# EAGLE design loochi-0.3a (EAGLE 6.2)
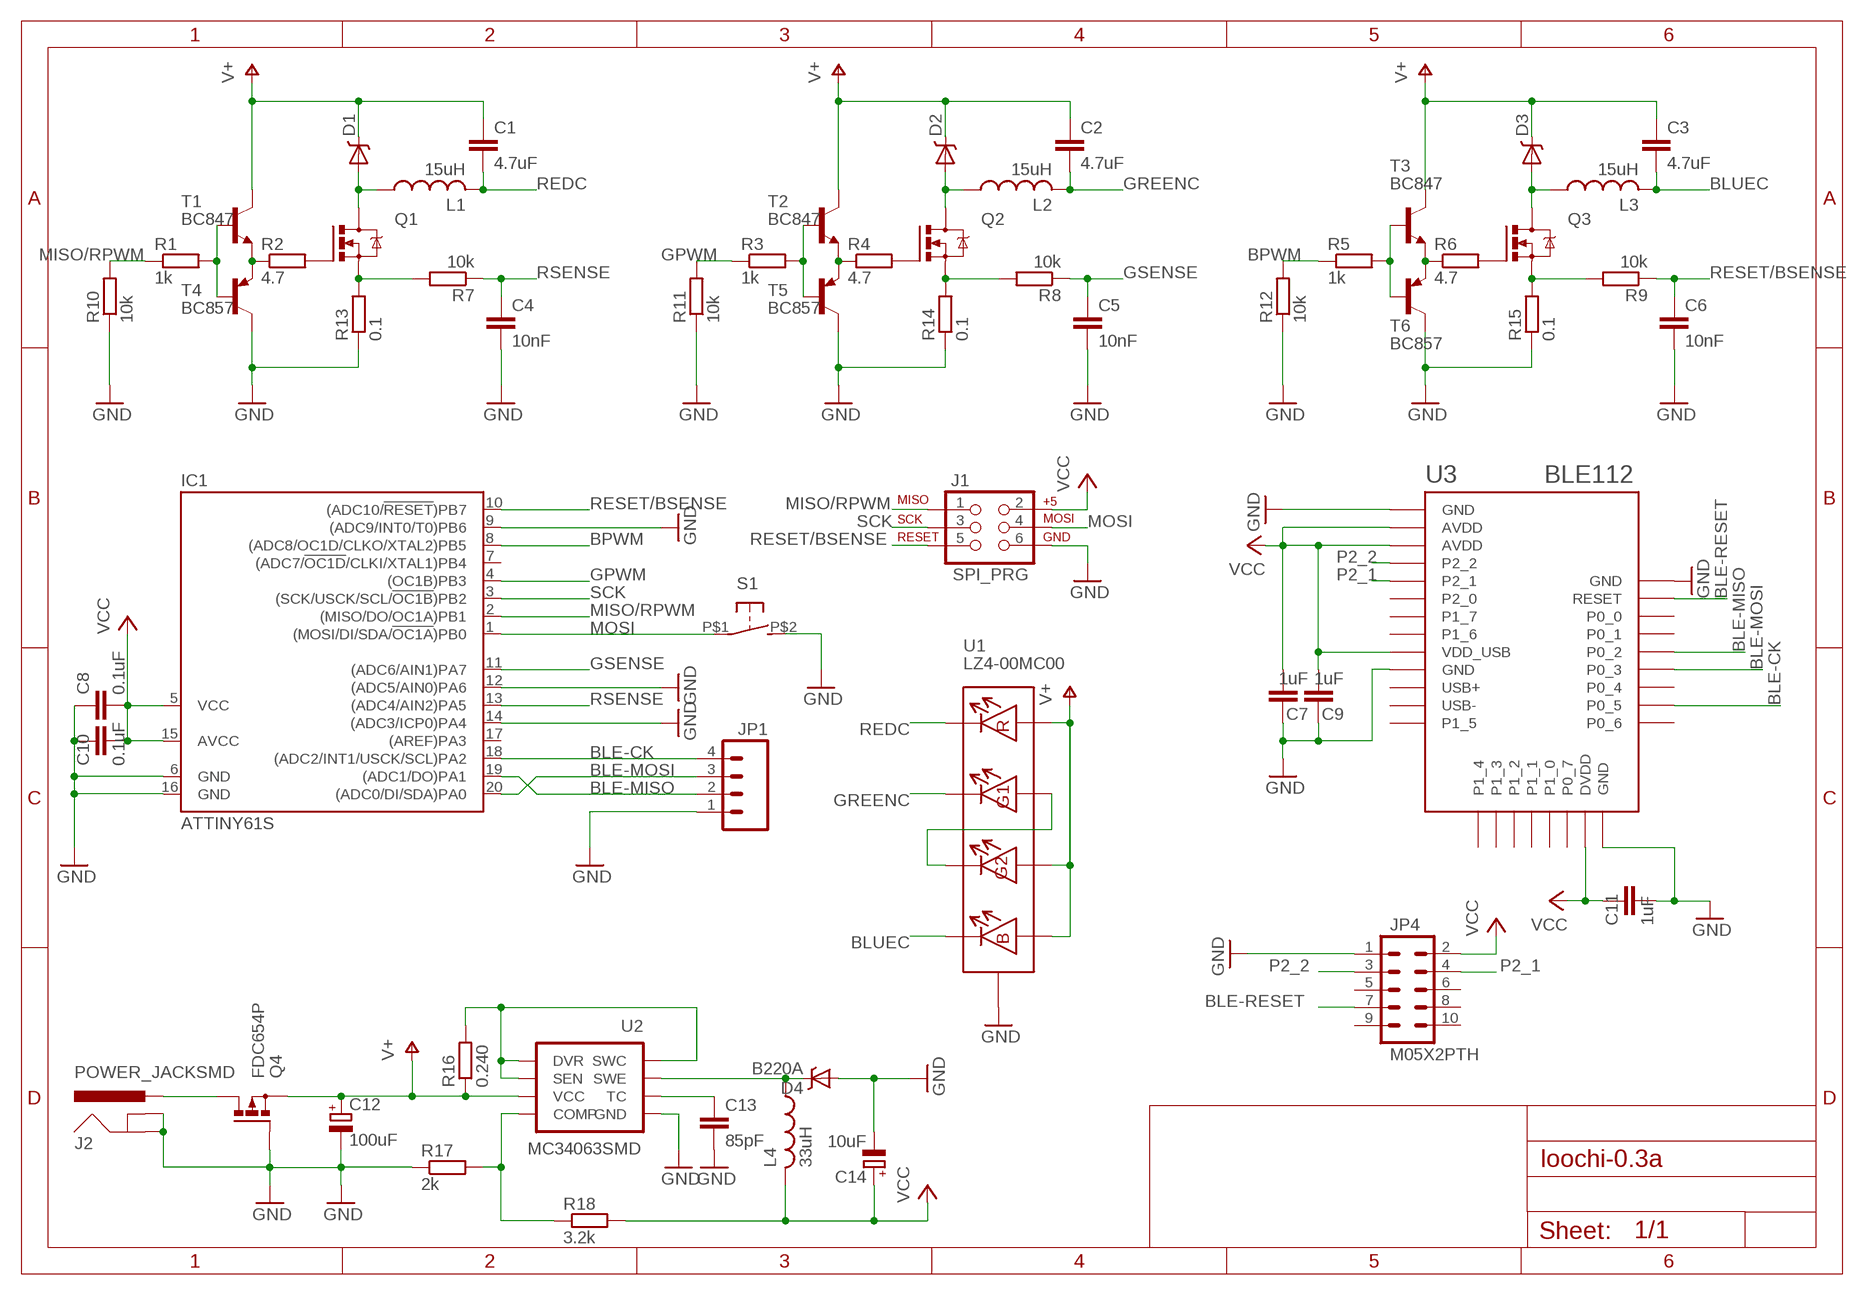
[diagram p0: schematic, sheet 1]

## Parts
C1  4.7uF  C-EUC0805  [C0805]
C2  4.7uF  C-EUC0805  [C0805]
C3  4.7uF  C-EUC0805  [C0805]
C4  10nF  C-EUC0805  [C0805]
C5  10nF  C-EUC0805  [C0805]
C6  10nF  C-EUC0805  [C0805]
C7  1uF  C-EUC0805  [C0805]
C8  0.1uF  C-EUC0805  [C0805]
C9  1uF  C-EUC0805  [C0805]
C10  0.1uF  C-EUC0805  [C0805]
C11  1uF  C-EUC0805  [C0805]
C12  100uF  CPOL-EUD  [PANASONIC_D]
C13  85pF  C-EUC0805  [C0805]
C14  10uF  CPOL-EUUD-4X5,8  [UD-4X5,8_NICHICON]
D1  PMEG4010CEH  DIODE-SCHOTTKY  [SOD123F]
D2  PMEG4010CEH  DIODE-SCHOTTKY  [SOD123F]
D3  PMEG4010CEH  DIODE-SCHOTTKY  [SOD123F]
D4  B220A  DIODE-SCHOTTKYBIGPAD  [SMA-DIODE-BIG]
IC1  ATTINY61S  [SO20L]
J1  SPI_PRG  AVR_SPI_PRG_6NS  [2X3-NS]
J2  POWER_JACKSMD  [POWER_JACK_SMD]
JP1  M04PTH  [1X04]
JP4  M05X2PTH  [AVR_ICSP]
L1  15uH  L-USBOURNS-6045  [BOURNS-6045]
L2  15uH  L-USBOURNS-6045  [BOURNS-6045]
L3  15uH  L-USBOURNS-6045  [BOURNS-6045]
L4  33uH  L-USBOURNS-6045  [BOURNS-6045]
Q1  PMN25ENSOT457  [SOT457]
Q2  PMN25ENSOT457  [SOT457]
Q3  PMN25ENSOT457  [SOT457]
Q4  FDC654P  [SUPERSOT6]
R1  1k  R-EU_R0805  [R0805]
R2  4.7  R-EU_R0805  [R0805]
R3  1k  R-EU_R0805  [R0805]
R4  4.7  R-EU_R0805  [R0805]
R5  1k  R-EU_R0805  [R0805]
R6  4.7  R-EU_R0805  [R0805]
R7  10k  R-EU_R0805  [R0805]
R8  10k  R-EU_R0805  [R0805]
R9  10k  R-EU_R0805  [R0805]
R10  10k  R-EU_R0805  [R0805]
R11  10k  R-EU_R0805  [R0805]
R12  10k  R-EU_R0805  [R0805]
R13  0.1  R-EU_R0805  [R0805]
R14  0.1  R-EU_R0805  [R0805]
R15  0.1  R-EU_R0805  [R0805]
R16  0.240  R-EU_R0805  [R0805]
R17  2k  R-EU_R0805  [R0805]
R18  3.2k  R-EU_R0805  [R0805]
S1  ALPS-SKRK39X29  [ALPS-SKRK-39X29]
T1  BC847  [SOT23]
T2  BC847  [SOT23]
T3  BC847  [SOT23]
T4  BC857  BC857A-PNP-SOT23-BEC  [SOT23-BEC]
T5  BC857  BC857A-PNP-SOT23-BEC  [SOT23-BEC]
T6  BC857  BC857A-PNP-SOT23-BEC  [SOT23-BEC]
U1  LZ4-00MC00  [LZ4-00MC00]
U2  MC34063SMD  [SO08]
U3  BLE112  SF-BLUEGIGA_BLE112-A-VISUAL  [SF-BLUEGIGA_BLE112-A]

## Nets
BLE-CK: IC1.18((ADC2/INT1/USCK/SCL)PA2) JP1.4 U3.P0_5
BLE-MISO: IC1.19((ADC1/DO)PA1) JP1.2 U3.P0_2
BLE-MOSI: IC1.20((ADC0/DI/SDA)PA0) JP1.3 U3.P0_3
BLE-RESET: JP4.7 U3.RESET
BLUEC: C3.2 L3.P$2 U1.P$8
BPWM: IC1.8((ADC8/OC1D/CLKO/XTAL2)PB5) R5.1 R12.2
GND: C4.2 C5.2 C6.2 C7.1 C8.1 C9.1 C10.1 C11.2 C12.- C13.2 C14.- D4.A IC1.6(GND) IC1.9((ADC9/INT0/T0)PB6) IC1.12((ADC5/AIN0)PA6) IC1.14((ADC3/ICP0)PA4) IC1.16(GND) J1.6 J2.GND(GNDBREAK) J2.P$4(GND) JP1.1 JP4.1 Q4.P$3(G) R10.1 R11.1 R12.1 R13.1 R14.1 R15.1 R17.1 S1.P$2(S) T4.C T5.C T6.C U1.THERMAL U1.THERMAL-VIA2(THERMAL) U1.THERMAL-VIA(THERMAL) U2.4(GND) U3.GND1(GND) U3.GND2(GND) U3.GND3(GND) U3.GND4(GND)
GPWM: IC1.4((OC1B)PB3) R3.1 R11.2
GREENC: C2.2 L2.P$2 U1.P$6
GSENSE: C5.1 IC1.11((ADC6/AIN1)PA7) R8.1
MISO/RPWM: IC1.2((MISO/DO/OC1A)PB1) J1.1 R1.1 R10.2
MOSI: IC1.1((MOSI/DI/SDA/!OC1A!)PB0) J1.4 S1.P$1(P)
N$1: U1.P$1 U1.P$5
N$3: R2.1 T1.2(E) T4.E
N$4: R1.2 T1.1(B) T4.B
N$5: Q1.P$3(G) R2.2
N$7: Q1.P$4(S) R7.2 R13.2
N$8: D1.P$A(A) L1.P$1 Q1.P$1(D) Q1.P$2(D) Q1.P$5(D) Q1.P$6(D)
N$9: R4.1 T2.2(E) T5.E
N$10: J2.VIN0(PWR) J2.VIN1(PWR) Q4.P$1(D) Q4.P$2(D) Q4.P$5(D) Q4.P$6(D)
N$11: R3.2 T2.1(B) T5.B
N$12: Q2.P$3(G) R4.2
N$14: D2.P$A(A) L2.P$1 Q2.P$1(D) Q2.P$2(D) Q2.P$5(D) Q2.P$6(D)
N$16: R16.2 U2.1(SWC) U2.7(SEN) U2.8(DVR)
N$17: Q2.P$4(S) R8.2 R14.2
N$18: C13.1 U2.3(TC)
N$19: R6.1 T3.2(E) T6.E
N$20: R5.2 T3.1(B) T6.B
N$21: Q3.P$3(G) R6.2
N$23: D3.P$A(A) L3.P$1 Q3.P$1(D) Q3.P$2(D) Q3.P$5(D) Q3.P$6(D)
N$24: D4.C L4.P$1 U2.2(SWE)
N$25: Q3.P$4(S) R9.2 R15.2
N$26: R17.2 R18.1 U2.5(COMP)
P2_1: JP4.4 U3.P2_1
P2_2: JP4.3 U3.P2_2
REDC: C1.2 L1.P$2 U1.P$4
RESET/BSENSE: C6.1 IC1.10((ADC10/!RESET!)PB7) J1.5 R9.1
RSENSE: C4.1 IC1.13((ADC4/AIN2)PA5) R7.1
SCK: IC1.3((SCK/USCK/SCL/!OC1B!)PB2) J1.3
V+: C1.1 C2.1 C3.1 C12.+ D1.P$C(C) D2.P$C(C) D3.P$C(C) Q4.P$4(S) R16.1 T1.3(C) T2.3(C) T3.3(C) U1.P$2 U1.P$3 U1.P$7 U2.6(VCC)
VCC: C7.2 C8.2 C9.2 C10.2 C11.1 C14.+ IC1.5(VCC) IC1.15(AVCC) J1.2 JP4.2 L4.P$2 R18.2 U3.AVDD1(AVDD) U3.AVDD2(AVDD) U3.DVDD U3.VDD_USB
Unconnected: IC1.7((ADC7/!OC1D!/CLKI/XTAL1)PB4) IC1.17((AREF)PA3) JP4.5 JP4.6 JP4.8 JP4.9 JP4.10 U3.P0_0 U3.P0_1 U3.P0_4 U3.P0_6 U3.P0_7 U3.P1_0 U3.P1_1 U3.P1_2 U3.P1_3 U3.P1_4 U3.P1_5 U3.P1_6 U3.P1_7 U3.P2_0 U3.USB+ U3.USB-

## Library data of the parts
C1-C11 C13 = rcl:C-EU: CAPACITOR, European symbol
C12 C14 = rcl:CPOL-EU: POLARIZED CAPACITOR, European symbol
D1-D4 = diode-schottky:DIODE-SCHOTTKY
IC1 = attinyx61:ATTINY*61: AtTinyX61; MPN: ATTINY261-20SU; OC_FARNELL: 1455147; OC_NEWARK: 58M3783
J1 = SparkFun:AVR_SPI_PRG_6: AVR ISP 6 Pin This is the reduced ISP connector for AVR programming. Common on Arduino. This footprint will take up less PCB space and can be used with a 10-pin to 6-pin adapter such as SKU: BOB-08508
J2 = SparkFun:POWER_JACK: Power Jack This is the standard 5.5mm barrel jack for power. The PTH is the most common, proven, reliable, footprint. All others are experimental. The Slot footprint only works if the mill layer is transmitted to the PCB fab house so be warned. Spark Fun Electronics SKU : PRT-00119. Mating wall wart : TOL-00298 (and others)
JP1 = SparkFun:M04: Header 4 Standard 4-pin 0.1" header. Use with straight break away headers (SKU : PRT-00116), right angle break away headers (PRT-00553), swiss pins (PRT-00743), machine pins (PRT-00117), and female headers (PRT-00115). Molex polarized connector foot print use with SKU : PRT-08231 with associated crimp pins and housings. 1MM SMD Version SKU: PRT-10208
JP4 = SparkFun:M05X2: Header 5x2 Standard 10-pin dual row 0.1" header. Commonly used with AVR-ISP. Use with Spark Fun Electronics SKU: PRT-00778
L1-L4 = inductors:L-US: INDUCTOR, American symbol
Q1-Q3 = mosfet:PMN25EN: N-CHANNEL MOS FET
Q4 = mosfet:FDC654P: FDC654P
R1-R18 = rcl:R-EU_: RESISTOR, European symbol
S1 = buttons:ALPS-SKRK: OMRON SWITCH
T1-T3 = transistor:BC847: NPN TRANSISTOR
T4-T6 = transistor:*-PNP-: PNP Transistror
U1 = ledengin:LZ4-00MC00
U2 = SparkFun:MC34063
U3 = ble112:SF-BLUEGIGA_BLE112-A-VISUAL: Bluetooth Low Energy single-mode module - Bluetooth 4.0, chip antenna

## Board
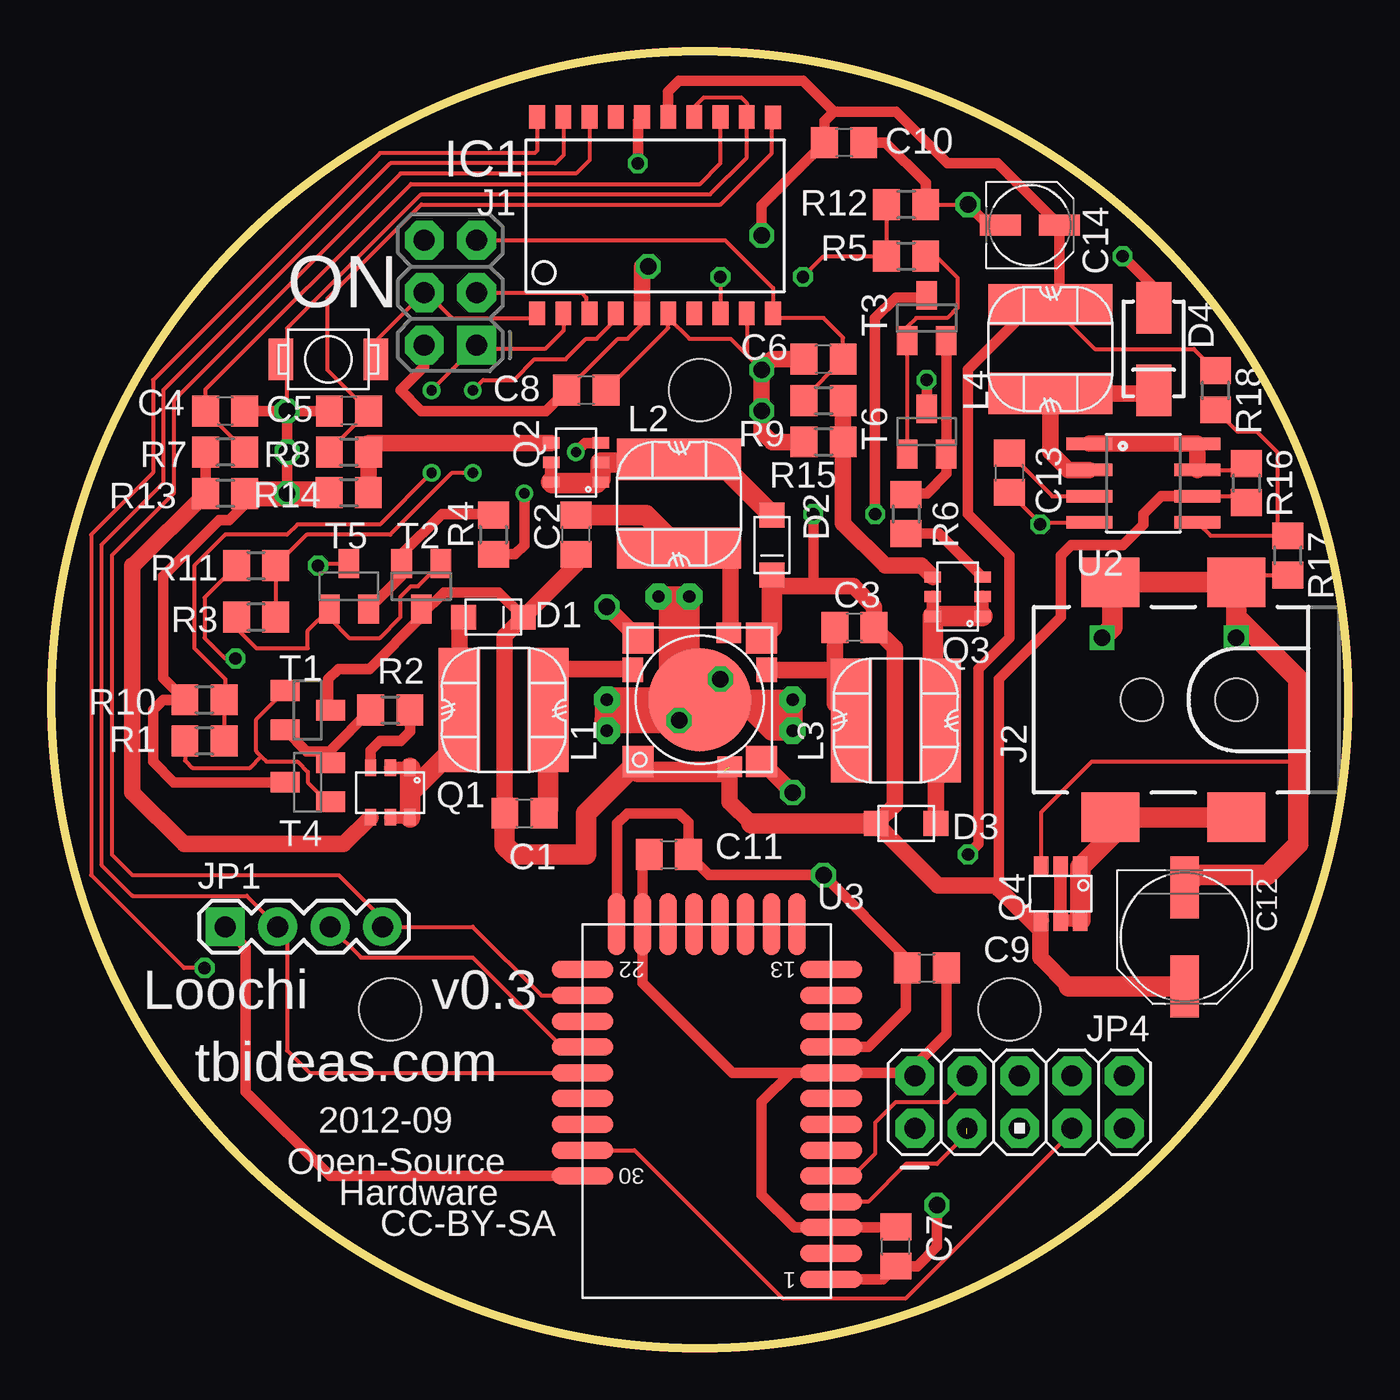
[diagram p1: board, top side]
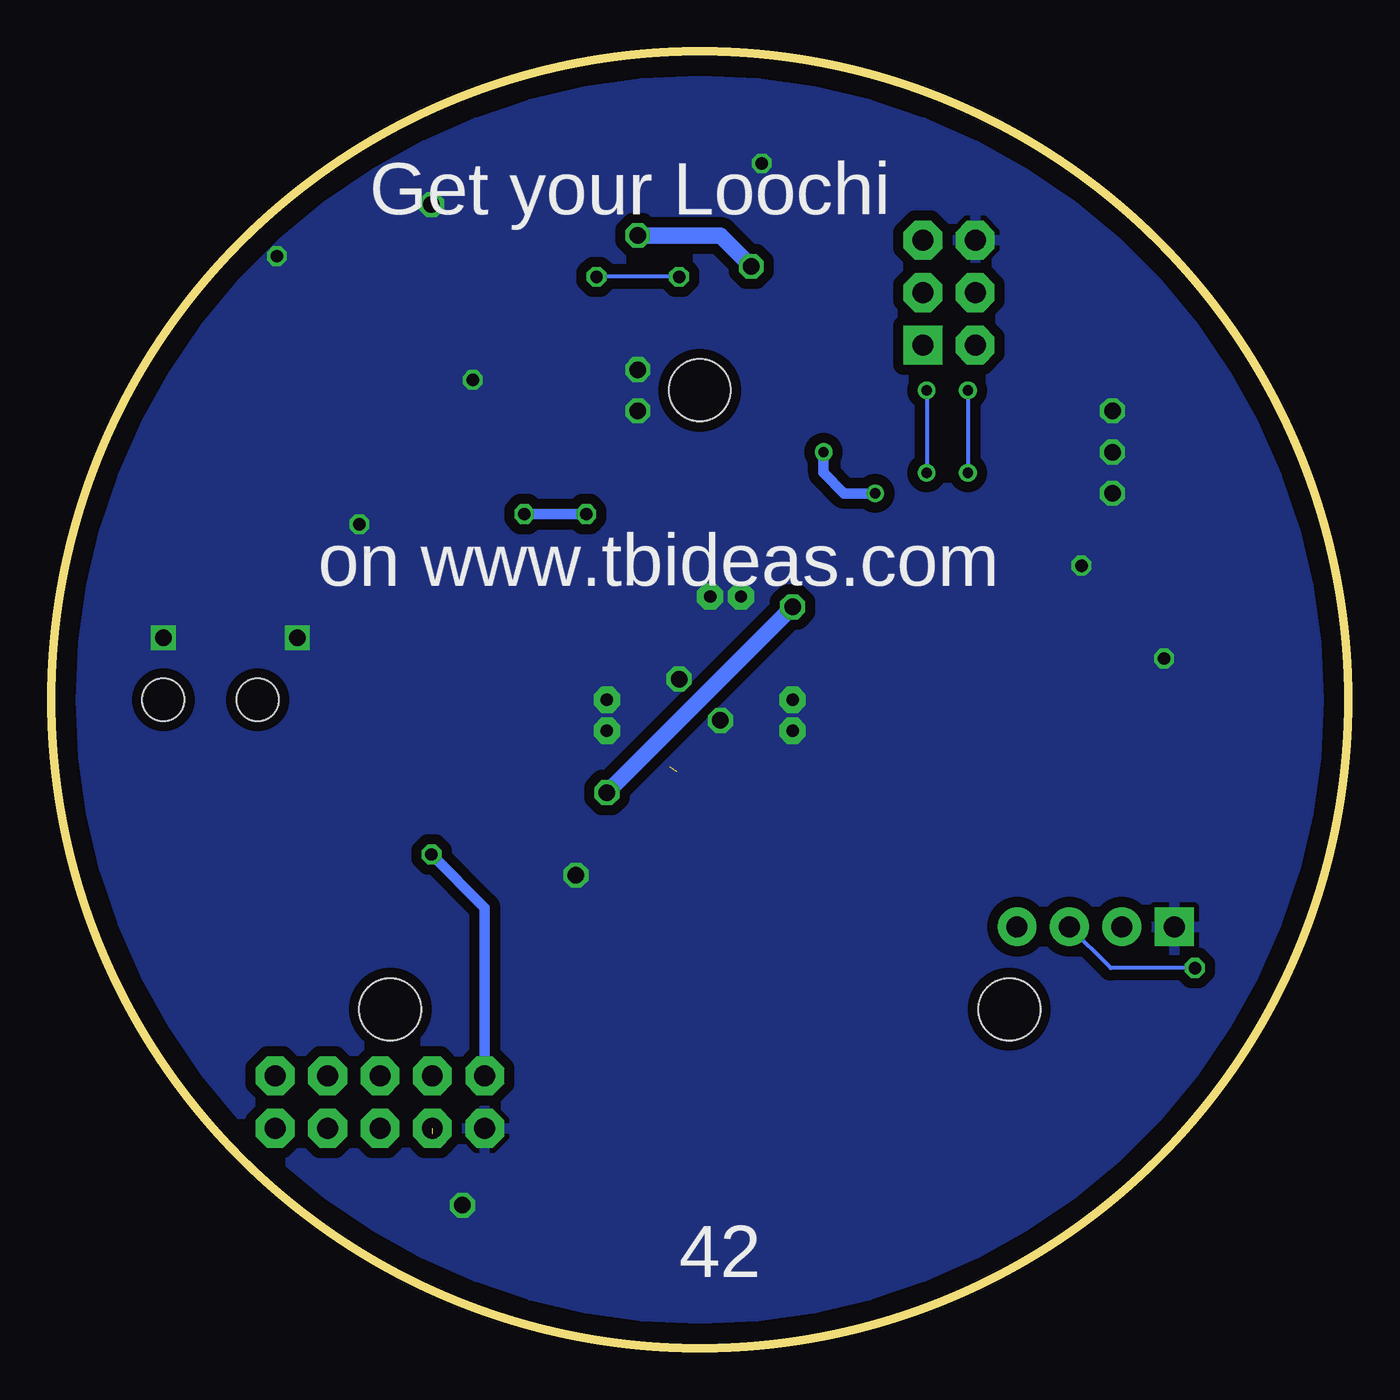
[diagram p2: board, bottom side, seen from below]

Size 62.83 x 62.83 mm. Coordinates in mm from the lower left corner, seen from the top.
Outline: circle at 31.42,31.42 radius 31.42
Copper layers (1*16): Top 0.0356mm / dielectric 1.5011mm / Bottom 0.0356mm
Design rules: minimum track width 6mil, minimum drill 13mil, track to track 6mil, track to pad 6mil, pad to pad 6mil, via to via 6mil, smd to smd 6mil, copper to edge 15mil, drill to drill 6mil, minimum pad ring 7mil, minimum via ring 7mil, stop-mask expansion 4mil, vias tented up to drill 0mil, thermal gap 10mil
Holes 3 mm at 46.42,16.42 16.42,16.42 31.42,46.42

### Footprints (pad centres in the part's own frame; a part is rotated, then mirrored left to right if it is on the bottom)
C0805 = smd 1.3 x 1.5: 1 -0.95,0; 2 0.95,0
PANASONIC_D = smd 3 x 1.4: + 2.4,0; - -2.4,0
UD-4X5,8_NICHICON = smd 2 x 1: + 1.425,0; - -1.425,0
SOD123F = smd 1.2 x 1.2: P$A -1.45,0; P$C 1.45,0
SMA-DIODE-BIG = smd 2.5 x 1.7: A -2,0; C 2,0
SO20L = smd 0.762 x 1.143: 1 -5.08,-5.131; 2 -3.81,-5.131; 3 -2.54,-5.131; 4 -1.27,-5.131; 5 0,-5.131; 6 1.27,-5.131; 7 2.54,-5.131; 8 3.81,-5.131; 9 5.08,-5.131; 10 6.35,-5.131; 11 6.35,4.369; 12 5.08,4.394; 13 3.81,4.394; 14 2.54,4.394; 15 1.27,4.394; 16 0,4.394; 17 -1.27,4.394; 18 -2.54,4.394; 19 -3.81,4.394; 20 -5.08,4.394
2X3-NS = drill 1.016 pad 1.88 square: 1 -2.54,-1.27 | drill 1.016 pad 1.88 octagon: 2 -2.54,1.27; 3 0,-1.27; 4 0,1.27; 5 2.54,-1.27; 6 2.54,1.27
POWER_JACK_SMD = smd 2.8 x 2.4: GND 0,-5.7; P$4 6.1,-5.7; VIN0 0,5.7; VIN1 6.1,5.7 | hole 2.032: 0,0; 4.572,0
1X04 = drill 1.016 pad 1.88 square: 1 0,0 | drill 1.016 pad 1.88: 2 2.54,0; 3 5.08,0; 4 7.62,0
AVR_ICSP = drill 1.016 pad 1.88 octagon: 1 -1.27,5.08; 2 1.27,5.08; 3 -1.27,2.54; 4 1.27,2.54; 5 -1.27,0; 6 1.27,0; 7 -1.27,-2.54; 8 1.27,-2.54; 9 -1.27,-5.08; 10 1.27,-5.08
BOURNS-6045 = smd 2 x 6: P$1 -2.15,0; P$2 2.15,0
SOT457 = smd 0.8 x 0.55: P$1 -1.2,0.95; P$2 -1.2,0; P$3 -1.2,-0.95; P$4 1.2,-0.95; P$5 1.2,0; P$6 1.2,0.95
SUPERSOT6 = smd 0.7 x 1: P$1 -0.95,-1.3; P$2 0,-1.3; P$3 0.95,-1.3; P$4 0.95,1.3; P$5 0,1.3; P$6 -0.95,1.3
R0805 = smd 1.3 x 1.5: 1 -0.95,0; 2 0.95,0
ALPS-SKRK-39X29 = smd 1.2 x 2: P$1 -2.3,0; P$2 2.3,0
SOT23 = smd 1 x 1.4: 1 -0.95,-1.1; 2 0.95,-1.1; 3 0,1.1
SOT23-BEC = smd 1 x 1.4: B -0.95,-1.1; C 0,1.1; E 0.95,-1.1
LZ4-00MC00 = smd 1.5 x 1.5: P$1 -3,3; P$3 3,3; P$5 3,-3; P$7 -3,-3 | smd 1.2 x 1: P$2 -1.45,3.25; P$6 -1.4,-3.25 | smd 1 x 1.2: P$4 3.25,-1.45; P$8 -3.25,-1.45 | smd 5 x 5: THERMAL 0,0 | drill 0.8 octagon: THERMAL-VIA -1,-1; THERMAL-VIA2 1,1
SO08 = smd 0.61 x 2.21: 1 -1.905,-2.616; 2 -0.635,-2.616; 3 0.635,-2.616; 4 1.905,-2.616; 5 1.905,2.616; 6 0.635,2.616; 7 -0.635,2.616; 8 -1.905,2.616
SF-BLUEGIGA_BLE112-A = smd 3 x 0.85: AVDD1 -6.05,6.9; AVDD2 -6.05,5.65; GND1 -6.05,8.15; GND2 -6.05,-3.1; GND4 6,3.15; P0_0 6,0.65; P0_1 6,-0.6; P0_2 6,-1.85; P0_3 6,-3.1; P0_4 6,-4.35; P0_5 6,-5.6; P0_6 6,-6.85; P1_5 -6.05,-6.85; P1_6 -6.05,-0.6; P1_7 -6.05,0.65; P2_0 -6.05,1.9; P2_1 -6.05,3.15; P2_2 -6.05,4.4; RESET 6,1.9; USB+ -6.05,-4.35; USB- -6.05,-5.6; VDD_USB -6.05,-1.85 | smd 0.85 x 3: DVDD 3.1,-9.05; GND3 4.35,-9.05; P0_7 1.85,-9.05; P1_0 0.6,-9.05; P1_1 -0.65,-9.05; P1_2 -1.9,-9.05; P1_3 -3.15,-9.05; P1_4 -4.4,-9.05

### Placement (x,y rotation side)
C1  22.92,25.92 0 top
C2  25.42,39.42 90 top
C3  38.92,34.92 180 top
C4  8.42,45.42 0 top
C5  14.42,45.42 180 top
C6  37.42,47.92 180 top
C7  40.92,4.92 90 top
C8  25.92,46.42 180 top
C9  42.42,18.42 0 top
C10  38.42,58.42 180 top
C11  29.92,23.92 0 top
C12  54.92,19.92 270 top
C13  46.42,42.42 270 top
C14  47.42,54.42 0 top
D1  21.42,35.42 0 top
D2  34.92,38.92 270 top
D3  41.42,25.42 180 top
D4  53.42,48.42 270 top
IC1  28.62,55.27 0 top
J1  19.34,51.15 90 top
J2  57.42,31.42 180 top
JP1  8.42,20.42 0 top
JP4  46.92,11.92 90 top
L1  21.92,30.92 0 top
L2  30.42,40.92 270 top
L3  40.92,30.42 180 top
L4  48.42,48.42 90 top
Q1  16.42,26.92 270 top
Q2  25.42,42.92 180 top
Q3  43.92,36.42 180 top
Q4  48.91,22.02 180 top
R1  7.42,29.42 180 top
R2  16.42,30.92 0 top
R3  9.92,35.42 180 top
R4  21.42,39.42 270 top
R5  41.42,52.92 0 top
R6  41.42,40.42 270 top
R7  8.42,43.42 180 top
R8  14.42,43.42 0 top
R9  37.42,45.92 0 top
R10  7.42,31.42 0 top
R11  9.92,37.92 0 top
R12  41.42,55.42 180 top
R13  8.42,41.42 180 top
R14  14.41,41.46 0 top
R15  37.42,43.92 0 top
R16  57.92,41.92 90 top
R17  59.92,38.42 90 top
R18  56.42,46.42 90 top
S1  13.42,47.92 180 top
T1  12.42,30.92 270 top
T2  17.92,36.92 180 top
T3  42.42,49.92 0 top
T4  12.42,27.42 90 top
T5  14.42,36.92 0 top
T6  42.42,44.42 0 top
U1  31.42,31.42 180 top
U2  52.92,41.92 270 top
U3  31.74,11.49 180 top

### Tracks (layer width: path | path; a pad name or v marks a point on that pad's centre or on a via)
BLE-CK
  Top 0.2: IC1.18 26.08,57.58 25.42,56.92 16.92,56.92 5.92,45.92 5.92,41.42 2.92,38.42 2.92,23.92 3.92,22.92 13.92,22.92 16.04,20.8 JP1.4 20.42,20.42 23.75,17.09 U3.P0_5
BLE-MISO
  Top 0.2: IC1.19 24.81,57.81 24.42,57.42 16.42,57.42 5.42,46.42 5.42,41.92 2.42,38.92 2.42,23.42 3.92,21.92 9.46,21.92 JP1.2 11.42,19.96 11.42,14.42 12.5,13.34 U3.P0_2
BLE-MOSI  (via drill 0.6)
  Top 0.2: IC1.20 23.54,58.04 23.42,57.92 15.92,57.92 4.92,46.92 4.92,42.42 1.92,39.42 1.92,22.92 6.42,18.42 v7.42,18.42 | JP1.3 15,18.92 20.42,18.92 24.75,14.59 U3.P0_3
  Bottom 0.2: v7.42,18.42 11.5,18.42 JP1.3
BLE-RESET
  Top 0.2: U3.RESET 28.25,9.59 35.42,2.42 41.42,2.42 49.46,10.46 JP4.7
BLUEC
  Top 0.8: C3.2 37.97,32.92 | 37.97,32.92 37.97,31.22 L3.P$2 | U1.P$8 37.92,32.87 37.97,32.92
  Top 1: 38.77,32.92 L3.P$2 38.42,30.77 38.42,30.92 38.97,31.47
BPWM  (via drill 0.6)
  Top 0.2: R12.2 R5.1 37.42,52.92 v36.42,51.92 | v32.42,51.92 IC1.8
  Bottom 0.2: v32.42,51.92 v36.42,51.92
GND  (via drill 0.6, 0.6 pad 1.27, 0.8)
  Top 0.2: C13.2 47.87,40.01 | 47.87,40.01 U2.4 | 33.42,59.94 IC1.12 | 31.12,59.7 IC1.14 31.16,60.16 31.62,60.62 33.42,60.62 33.7,60.34 IC1.12 | IC1.12 33.7,57.7 31.92,55.92 17.92,55.92 11.42,49.42 11.42,48.22 | 11.42,44.92 v11.42,45.42 11.42,48.22 | R11.1 7.42,36.37 7.42,34.42 8.42,33.42 v8.92,33.42 | v12.92,37.92 13.02,38.02 T5.C | R12.1 v44.42,55.42 | 47.87,40.01 47.92,39.97 v47.92,39.92 | 11.42,48.22 S1.P$2 | C8.1 29.89,49.44 IC1.6 29.89,49.95 30.92,48.92 32.92,48.92 v34.42,47.42 33.7,48.14 IC1.9 | J2.GND 57.77,37.47 R17.1 | 60.42,28.42 50.42,28.42 47.96,25.96 Q4.P$3
  Top 0.5: C4.2 10.92,45.42 11.42,44.92 | 11.42,44.92 v11.42,43.42 v11.42,41.42 | C5.2 11.92,45.42 11.42,44.92 | IC1.16 28.42,59.46 v28.42,57.42 | T6.C v42.42,46.92 | C14.- 45.42,54.42 v44.42,55.42 | v51.92,52.92 53.42,51.42 D4.A | U3.GND3 27.42,20.57 27.42,25.42 27.92,25.92 30.42,25.92 30.87,25.47 C11.2 31.87,22.92 v37.42,22.92 41.47,18.87 C9.1 41.42,18.37 41.42,16.42 39.59,14.59 U3.GND2 | T4.C 5.92,27.42 4.92,28.42 4.92,30.92 5.42,31.42 R10.1 5.42,32.47 5.42,37.42 8.12,40.12 8.62,40.12 9.42,40.92 9.42,41.37 R13.1 9.37,41.37 | U3.GND1 40.29,3.34 C7.1 41.97,3.97 42.92,4.92 v42.92,6.92 | R12.1 42.37,56.47 40.42,58.42 C10.1 | JP1.1 9.42,19.42 9.42,12.42 13.5,8.34 U3.GND4
  Top 0.8: R15.1 34.92,43.92 34.42,44.42 v34.42,47.42 34.92,47.92 C6.2
  Top 1: 30.92,31.42 U1.THERMAL 34.42,31.42 | 34.42,31.42 v35.92,31.42 v35.92,29.92 | 34.42,31.42 v35.92,29.92 | v35.92,29.92 34.92,29.92 33.92,30.92 | v29.42,36.42 29.92,36.42 | 29.92,36.42 v30.92,36.42 30.92,31.42 | 30.92,31.42 29.92,32.42 29.92,36.42 | J2.P$4 J2.GND 57.42,35.42 | 57.42,35.42 v57.42,34.42 | v50.92,34.42 51.42,34.92 51.42,36.92 | C12.- 55.52,22.92 58.92,22.92 60.42,24.42 60.42,28.42 60.42,32.42 57.42,35.42
  Top 1.2: R13.1 v11.42,41.42 13.42,41.42 R14.1 | 26.92,30.42 v26.92,31.42 29.42,31.42 U1.THERMAL-VIA2 26.92,30.42 | v26.92,29.92 26.92,30.42
  other vias: 34.42,45.42
  pour Bottom (isolate 0.5, rank 2): 31.42,61.42 arc-90 61.42,31.42 arc-90 31.42,1.42 arc-90 1.42,31.42 arc-90
GPWM  (via drill 0.5)
  Top 0.2: v20.42,46.42 20.92,46.92 22.42,46.92 23.42,47.92 24.92,47.92 25.92,48.92 26.42,48.92 27.35,49.85 IC1.4 | R3.1 R11.2 12.37,39.42 16.42,39.42 19.42,42.42 v20.42,42.42
  Bottom 0.2: v20.42,46.42 v20.42,42.42
GREENC
  Top 0.8: 32.92,38.62 32.92,38.92 | 32.92,38.62 30.57,38.62 L2.P$2 | 32.92,38.62 32.92,34.77 U1.P$6
  Top 1: C2.2 28.82,40.37 L2.P$2
GSENSE
  Top 0.2: IC1.11 34.92,59.58 34.92,57.92 32.42,55.42 17.92,55.42 13.37,50.87 13.37,47.42 C5.1 13.47,43.52 R8.1
MISO/RPWM  (via drill 0.5)
  Top 0.2: IC1.2 24.81,49.31 23.92,48.42 20.8,48.42 J1.1 v18.42,46.42 | v18.42,42.42 15.92,39.92 11.92,39.92 11.42,39.42 8.42,39.42 6.92,37.92 6.92,33.92 8.42,32.42 8.42,31.47 R10.2 R1.1
  Bottom 0.2: v18.42,46.42 v18.42,42.42
MOSI
  Top 0.2: IC1.1 23.32,49.92 19.42,49.92 18.19,51.15 J1.4 15.72,48.8 S1.P$1
N$1  (via drill 0.8)
  Top 0.8: U1.P$5 v26.92,35.92 | v35.92,26.92 U1.P$1
  Bottom 0.8: v26.92,35.92 v35.92,26.92
N$3
  Top 0.2: T4.E 13.47,28.42 13.47,28.92
  Top 0.5: T1.2 12.37,28.92 13.47,28.92 R2.1
N$4
  Top 0.2: T1.1 9.92,30.47 9.92,28.92 10.17,28.67 | 6.47,28.87 R1.2 6.47,28.47 6.82,28.12 9.62,28.12 10.17,28.67 | 10.17,28.67 10.42,28.42 11.92,28.42 12.42,27.92 12.42,27.42 13.37,26.47 T4.B
N$5
  Top 0.5: R2.2 17.37,29.87 16.92,29.42 15.92,29.42 15.47,28.97 Q1.P$3
N$7
  Top 0.5: R7.2 R13.2
  Top 0.8: Q1.P$4 14.17,24.42 6.42,24.42 3.92,26.92 3.92,37.92 3.97,37.92 R13.2
N$8
  Top 0.6: Q1.P$1 Q1.P$2 | Q1.P$6 Q1.P$5
  Top 0.8: D1.P$A 19.77,35.22 L1.P$1
  Top 1: Q1.P$6 17.37,26.92 | Q1.P$1 17.37,26.92 | L1.P$1 19.77,29.32 17.37,26.92
N$9
  Top 0.5: T5.E 16.97,37.42 T2.2 16.97,38.47 18.92,40.42 21.37,40.42 R4.1
N$10
  Top 0.6: Q4.P$2 Q4.P$5 Q4.P$6
  Top 1: J2.VIN0 J2.VIN1 51.32,24.78 Q4.P$1 Q4.P$6
N$11
  Top 0.2: R3.2 8.97,34.87 9.92,33.92 12.42,33.92 12.42,34.77 T5.B 13.47,35.37 14.42,34.42 15.92,34.42 16.92,35.42 16.92,36.42 17.42,36.92 17.77,36.92 T2.1
N$12  (via drill 0.5)
  Top 0.5: 22.87,41.37 v22.92,41.42 22.92,38.92 22.47,38.47 R4.2 | v25.42,43.42 25.87,43.87 Q2.P$3
  Bottom 0.5: v22.92,41.42 24.42,41.42 25.42,42.42 v25.42,43.42
N$14
  Top 0.6: Q2.P$5 Q2.P$6 | Q2.P$2 Q2.P$1
  Top 1: D2.P$A 32.22,43.07 L2.P$1 30.27,42.92 Q2.P$2 26.62,42.12 26.42,41.92 24.27,41.92 Q2.P$6
N$16
  Top 0.2: U2.7 57.6,42.55 R16.2
  Top 0.8: U2.1 U2.8 U2.7
N$17
  Top 0.2: 15.36,43.87 15.37,43.87 R8.2
  Top 0.5: R14.2
  Top 0.8: Q2.P$4 15.36,43.87 R14.2
N$18
  Top 0.2: C13.1 48.5,41.28 U2.3
N$19
  Top 0.5: T3.2 T6.E 43.37,42.37 42.42,41.42 41.47,41.42 R6.1
N$20
  Top 0.2: T6.B T3.1 41.47,49.47 41.92,49.92 43.42,49.92 43.92,50.42 43.92,51.87 42.87,52.92 R5.2
N$21
  Top 0.5: R6.2 43.02,39.47 Q3.P$3
N$23
  Top 0.6: Q3.P$5 Q3.P$6 | Q3.P$2 Q3.P$1
  Top 0.8: L3.P$1 42.87,30.22 D3.P$A
  Top 1: L3.P$1 42.72,30.77 Q3.P$6 Q3.P$1
N$24
  Top 0.8: D4.C 53.27,46.27 L4.P$1 48.42,43.42 49.28,42.55 U2.2
N$25
  Top 0.8: Q3.P$4 42.17,37.92 40.42,37.92 38.37,39.97 R15.2 R9.2
N$26
  Top 0.2: U2.5 56.18,39.37 R17.2 59.42,39.87 59.42,43.42 58.42,44.42 57.47,44.42 R18.1
P2_1
  Top 0.2: U3.P2_1 38.84,8.34 39.92,9.42 39.92,10.92 40.92,11.92 43.42,11.92 44.38,12.88 JP4.4 44.38,13.38
P2_2  (1 unrouted)
  Top 0.2: 39.09,7.09 U3.P2_2 39.59,7.09 41.42,8.92 42.92,8.92 44.38,10.38
REDC
  Top 0.8: U1.P$4 28.12,32.92 24.42,32.92 24.07,32.57 L1.P$2
  Top 1: L1.P$2 24.07,26.12 C1.2
RESET/BSENSE
  Top 0.2: R9.1 36.47,46.02 C6.1 38.37,48.97 37.42,49.92 35.18,49.92 IC1.10 34.97,51.37 32.65,53.69 J1.5
  Top 0.5: 34.92,50.08 IC1.10
RSENSE
  Top 0.2: IC1.13 32.42,57.42 31.42,56.42 17.42,56.42 7.47,46.47 C4.1 9.37,43.52 R7.1
SCK
  Top 0.2: J1.3 25.69,51.15 25.92,50.92 25.92,50.29 IC1.3
V+  (via drill 0.6)  (1 unrouted)
  Top 0.2: U2.6 57.6,41.28 R16.1
  Top 0.5: T3.3 42.32,50.92 40.92,50.92 39.92,49.92 v39.92,40.42 | v36.92,40.42 36.92,36.92 | U2.6 53.78,41.28 52.92,40.42 52.92,39.92 51.92,38.92 49.42,38.92 48.92,38.42 48.92,35.42 45.92,32.42 45.92,22.42 | T2.3 17.92,35.52 | T1.3 13.42,31.02 13.42,32.42 13.92,32.92 15.42,32.92 17.92,35.42 17.92,35.52 | 17.92,35.52 19.02,36.62 21.67,36.62 D1.P$C
  Top 0.8: C1.1 21.97,34.52 D1.P$C 25.42,37.97 C2.1 | 38.92,25.42 D3.P$C | 34.92,36.92 36.92,36.92 38.87,36.92 39.87,35.92 C3.1 40.87,33.92 40.87,26.32 D3.P$C | D3.P$C 42.97,22.42 45.92,22.42 45.92,22.26 47.92,20.26 | 33.92,25.42 32.87,26.47 U1.P$2 | 49.32,17.52 47.92,18.92 47.92,20.26 | 47.92,20.26 47.92,20.68 Q4.P$4
  Top 1: 32.52,27.92 28.42,27.92 U1.P$3 25.92,25.92 25.92,23.92 22.42,23.92 21.97,24.37 C1.1 | 33.92,25.42 D3.P$C | D2.P$C 34.92,36.92 34.92,34.92 U1.P$7 | C12.+ 49.32,17.52
  Bottom 0.5: v39.92,40.42 v36.92,40.42
VCC  (via drill 0.6, 0.8)
  Top 0.2: L4.P$2 50.57,48.42 55.37,48.42 R18.2 | U3.AVDD2 U3.AVDD1 | C8.2 27.47,48.92 27.92,48.92 28.62,49.62 IC1.5
  Top 0.5: J1.2 18.07,47.57 16.92,46.42 17.92,45.42 23.97,45.42 C8.2 | v44.42,23.92 44.92,24.42 44.92,32.92 46.42,34.42 46.42,38.42 44.42,40.42 44.42,47.42 47.57,50.57 L4.P$2 48.84,50.99 C14.+ 45.84,57.42 43.42,57.42 40.92,59.92 37.92,59.92 | 35.84,13.34 34.42,11.92 34.42,7.42 36,5.84 U3.AVDD2 40.89,5.84 C7.2 | 35.84,13.34 U3.VDD_USB 41.69,13.34 JP4.2 41.84,13.69 43.37,15.22 C9.2 | 35.84,13.34 33,13.34 28.64,17.7 U3.DVDD 28.64,23.59 C11.1 | IC1.15 29.89,60.89 30.42,61.42 36.42,61.42 37.92,59.92 | v34.42,53.92 34.42,55.37 C10.2 37.47,59.47 37.92,59.92
  Top 0.8: IC1.5 28.62,52.42 v28.92,52.42
  Bottom 0.5: v44.42,23.92 41.84,21.34 JP4.2
  Bottom 0.8: v28.92,52.42 30.42,53.92 v34.42,53.92

### Text on the board
_tsilk: ON | Loochi | v0.3 | tbideas.com | 2012-09 | Open-Source | Hardware | CC-BY-SA
_bsilk: Get your Loochi | on www.tbideas.com | 42